# Altium schematic sheet MCU.SchDoc: ROBOX V2 - Microcontroller
size A4; DrawnBy: Jan Stappers; DocumentNumber: JSP016; Revision: B; SheetNumber: 2; SheetTotal: 6
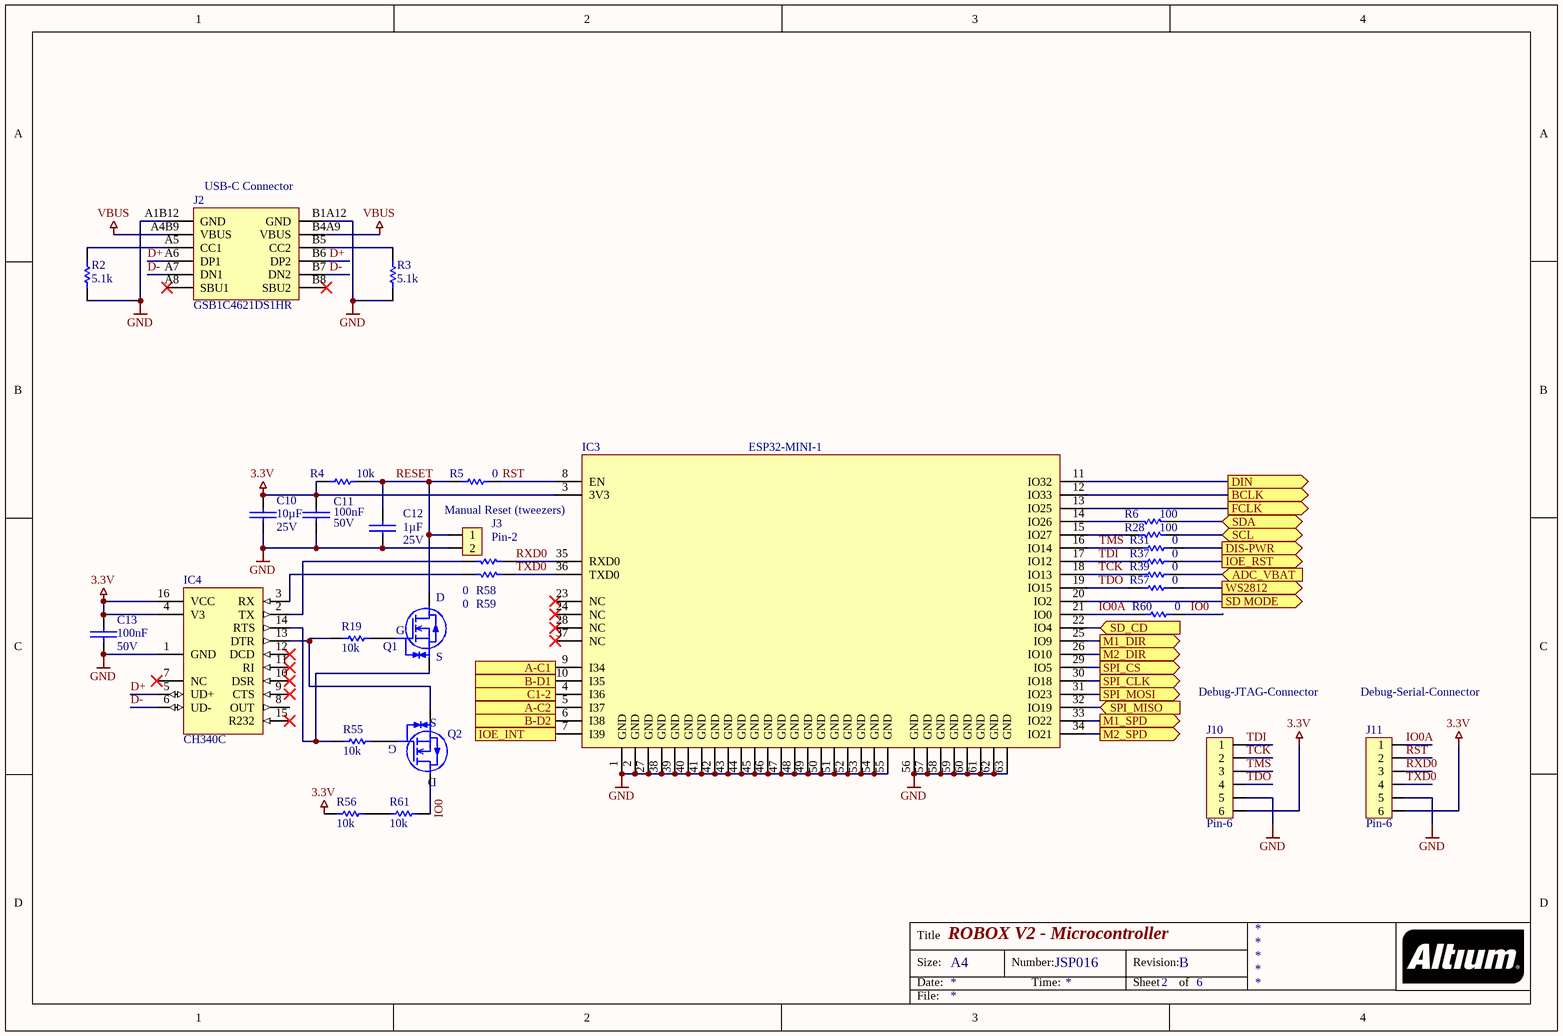
[diagram p0: MCU.SchDoc]

## Parts
C10  value 10µF  voltage: 25V  [C0603]  (hidden comment: cap_non_pol)
C11  value 100nF  voltage: 50V  [C0402]  (hidden comment: cap_non_pol)
C12  value 1µF  voltage: 25V  [C0603]  (hidden comment: cap_non_pol)
C13  value 100nF  voltage: 50V  [TH5.08]  (hidden comment: cap_non_pol)
IC3  ESP32-MINI-1  [ESP32-MINI-1]
IC4  CH340C  [SOP-16]
J2  GSB1C4621DS1HR  [GSB1C4621DS1HR]
J3  Pin-2  [2-PIN-EMPTY]
J10  Pin-6  [6-PIN-EMPTY]
J11  Pin-6  [6-PIN-EMPTY]
Q1  N_CH_MOSFET  [SOT-23(-3)]  (value not drawn)
Q2  N_CH_MOSFET  [SOT-23(-3)]  (value not drawn)
R2  value 5.1k  [R0402]  (hidden comment: resistor)
R3  value 5.1k  [R0402]  (hidden comment: resistor)
R4  value 10k  [R0402]  (hidden comment: resistor)
R5  value 0  [R0402]  (hidden comment: resistor)
R6  value 100  [R0402]  (hidden comment: resistor)
R19  value 10k  [R0402]  (hidden comment: resistor)
R28  value 100  [R0402]  (hidden comment: resistor)
R31  value 0  [R0402]  (hidden comment: resistor)
R37  value 0  [R0402]  (hidden comment: resistor)
R39  value 0  [R0402]  (hidden comment: resistor)
R55  value 10k  [R0402]  (hidden comment: resistor)
R56  value 10k  [R0402]  (hidden comment: resistor)
R57  value 0  [R0402]  (hidden comment: resistor)
R58  value 0  [R0402]  (hidden comment: resistor)
R59  value 0  [R0402]  (hidden comment: resistor)
R60  value 0  [R0402]  (hidden comment: resistor)
R61  value 10k  [R0402]  (hidden comment: resistor)

## Ports
A-C1 (in), A-C2 (in), ADC_VBAT (in), B-D1 (in), B-D2 (in), BCLK (out), C1-2 (in), DIN (out), DIS-PWR (out), FCLK (out), IOE_INT (in), IOE_RST (out), M1_DIR (out), M1_SPD (out), M2_DIR (out), M2_SPD (out), SCL (bidir), SD MODE (out), SD_CD (in), SDA (bidir), SPI_CLK (out), SPI_CS (out), SPI_MISO (in), SPI_MOSI (out), WS2812 (out)

## Nets
3.3V: C10.1 C11.2 C13.1 IC3.3(3V3) IC4.4(V3) IC4.16(VCC) J10.6 J11.6 R4.2 R56.1
GND: C10.2 C11.1 C12.2 C13.2 IC3.1(GND) IC3.2(GND) IC3.27(GND) IC3.38(GND) IC3.39(GND) IC3.40(GND) IC3.41(GND) IC3.42(GND) IC3.43(GND) IC3.44(GND) IC3.45(GND) IC3.46(GND) IC3.47(GND) IC3.48(GND) IC3.49(GND) IC3.50(GND) IC3.51(GND) IC3.52(GND) IC3.53(GND) IC3.54(GND) IC3.55(GND) IC3.56(GND) IC3.57(GND) IC3.58(GND) IC3.59(GND) IC3.60(GND) IC3.61(GND) IC3.62(GND) IC3.63(GND) IC4.1(GND) J2.A1B12(GND) J2.B1A12(GND) J3.2 J10.5 J11.5 R2.2 R3.2
VBUS: J2.A4B9(VBUS) J2.B4A9(VBUS)
A-C1: IC3.9(I34) ; port A-C1
A-C2: IC3.5(I37) ; port A-C2
ADC_VBAT: R39.1 ; port ADC_VBAT
B-D1: IC3.10(I35) ; port B-D1
B-D2: IC3.6(I38) ; port B-D2
BCLK: IC3.12(IO33) ; port BCLK
C1-2: IC3.4(I36) ; port C1-2
D+: IC4.5(UD+) J2.A6(DP1) J2.B6(DP2)
D-: IC4.6(UD-) J2.A7(DN1) J2.B7(DN2)
DIN: IC3.11(IO32) ; port DIN
DIS-PWR: R31.1 ; port DIS-PWR
FCLK: IC3.13(IO25) ; port FCLK
IO0: Q2.3(D) R60.1 R61.2
IO0A: IC3.21(IO0) J11.1 R60.2
IOE_INT: IC3.7(I39) ; port IOE_INT
IOE_RST: R37.1 ; port IOE_RST
M1_DIR: IC3.25(IO9) ; port M1_DIR
M1_SPD: IC3.33(IO22) ; port M1_SPD
M2_DIR: IC3.26(IO10) ; port M2_DIR
M2_SPD: IC3.34(IO21) ; port M2_SPD
RESET: C12.1 J3.1 Q1.3(D) R4.1 R5.2
RST: IC3.8(EN) J11.2 R5.1
RXD0: IC3.35(RXD0) J11.3 R58.1
SCL: R28.2 ; port SCL
SD MODE: IC3.20(IO2) ; port SD MODE
SD_CD: IC3.22(IO4) ; port SD_CD
SDA: R6.2 ; port SDA
SPI_CLK: IC3.30(IO18) ; port SPI_CLK
SPI_CS: IC3.29(IO5) ; port SPI_CS
SPI_MISO: IC3.32(IO19) ; port SPI_MISO
SPI_MOSI: IC3.31(IO23) ; port SPI_MOSI
TCK: IC3.18(IO13) J10.2 R39.2
TDI: IC3.17(IO12) J10.1 R37.2
TDO: IC3.19(IO15) J10.4 R57.2
TMS: IC3.16(IO14) J10.3 R31.2
TXD0: IC3.36(TXD0) J11.4 R59.1
WS2812: R57.1 ; port WS2812
NetIC3_14: IC3.14(IO26) R6.1
NetIC3_15: IC3.15(IO27) R28.1
NetIC4_2: IC4.2(TX) R58.2
NetIC4_3: IC4.3(RX) R59.2
NetIC4_13: IC4.13(DTR) Q2.2(S) R19.1
NetIC4_14: IC4.14(RTS) Q1.2(S) R55.1
NetJ2_A5: J2.A5(CC1) R2.1
NetJ2_B5: J2.B5(CC2) R3.1
NetQ1_1: Q1.1(G) R19.2
NetQ2_1: Q2.1(G) R55.2
NetR56_2: R56.2 R61.1

Not connected (* = marked no-connect by the designer): IC3 23(NC)* 24(NC)* 28(NC)* 37(NC)*; IC4 7(NC)* 8(OUT) 9(CTS)* 10(DSR)* 11(RI)* 12(DCD)* 15(R232)*; J2 A8(SBU1)* B8(SBU2)*

## Notes on the sheet
- (near J2) USB-C Connector
- (near IC3) Manual Reset (tweezers)
- (near J10) Debug-JTAG-Connector
- (near J11) Debug-Serial-Connector
- Title
- Size:
- Date:
- A4
- Number:
- Time:
- Revision:
- Sheet
- of
- File:

## Library data of the parts
C10 = 1: CAP CER 10UF 25V X5R 10% SMD; manufacturer_ref: GRM188R61E106KA73D; manufacturer: Murata Electronics; id: 1; tolerance: 10%; dielectric: X5R; package: 0603; supplier_1: digikey; supplier_1_partnumber: 490-18214-1-ND; price: 0,06969; status: active
C11 = 0: CAP CER 0.1UF 50V X5R 0402; manufacturer_ref: 490-16356-1-ND; manufacturer: Murata Electronics; id: 0; tolerance: 5%; dielectric: X5R; package: 0402; supplier_1: digikey; supplier_1_partnumber: 490-16356-1-ND; price: 0,00933; status: non stock
C12 = 34: CAP CER 1UF 25V X5R 0603; manufacturer_ref: CC0603KRX5R8BB105; manufacturer: YAGEO; id: 34; tolerance: 10%; dielectric: X5R; package: 0603; supplier_1: digikey; supplier_1_partnumber: 311-1445-1-ND; price: 0,01837; status: active
C13 = 51: CAP CER TH 100nF X7R 50V; manufacturer_ref: C2761753; manufacturer: FH; id: 51; tolerance: 10%; dielectric: X7R; package: TH5.08; supplier_1: lcsc; supplier_1_partnumber: C385200; price: 0,0237; status: active
IC3 = 80: RF TXRX MOD BT TRACE ANT CHAS MT; manufacturer_ref: ESP32-MINI-1-N4; manufacturer: Espressif Systems; id: 80; type: MCU Wireless (Bluetooth); package: 63-SMD; supplier_1: digikey; supplier_1_partnumber: 1965-ESP32-MINI-1-N4CT-ND; price: 2,12; status: active
IC4 = 79: 2Mbps Transceiver USB 2.0 SOP-16 USB ICs ROHS; manufacturer: WCH(Jiangsu Qin Heng); id: 79; manufacturer_ref: CH340C; type: Wired (USB TO SERIAL); package: 16-SOP; supplier_1: lcsc; supplier_1_partnumber: C84681; price: 0,4996; status: active
J2 = 55: USB2.0, TYPE C, MID MOUNT, CENTE; manufacturer: Amphenol ICC (Commercial Products); id: 55; nbr_positions_total: 16; manufacturer_ref: GSB1C4621DS1HR; package: Pin-16DR; supplier_1: digikey; supplier_1_partnumber: 664-GSB1C4621DS1HRCT-ND; price: 0,52; status: active
J3 = 18: CONN TH solder pad; manufacturer_ref: TH-2; id: 18; nbr_positions_total: 2; package: Pin-2SR; price: 0
J10 J11 = 60: CONN TH solder pad; manufacturer_ref: 6-Pin TH; id: 60; nbr_positions_total: 6; package: Pin-6SR; price: 0; status: active
Q1 Q2 = 7: MOSFET N-CH 100V 170MA SOT23-3; manufacturer_ref: BSS123-7-F; manufacturer: Diodes Incorporated; id: 7; current_rating: 0.170A; voltage_vgs_min: 20V; type: N channel; voltage_vds: 100V; package: SOT23-3; supplier_1: digikey; supplier_1_partnumber: NTR4003NT1GOSCT-ND; price: 0,0395; status: active
R2 R3 = 94: RES 5.1K OHM 1% 1/16W 0402; manufacturer_ref: RMCF0402FT5K10; manufacturer: Stackpole Electronics Inc; id: 94; tolerance: 1%; power: 1/16W; package: 0402; supplier_1: digikey; supplier_1_partnumber: RMCF0402FT5K10CT-ND; price: 0,09; status: active
R4 R19 R55 R56 R61 = 6: RES SMD 10K OHM 1% 1/10W 0402; manufacturer_ref: ERJ-2RKF1002X; manufacturer: Panasonic Electronic Components; id: 6; tolerance: 1%; power: 1/10W; package: 0402; supplier_1: digikey; supplier_1_partnumber: P10.0KLCT-ND; price: 0,00703; status: active
R5 R31 R37 R39 R57-R60 = 8: RES SMD 0 OHM JUMPER 1/10W 0402; manufacturer_ref: ERJ-2GE0R00X; manufacturer: Panasonic Electronic Components; id: 8; tolerance: 1%; power: 1/10W; package: 0402; supplier_1: digikey; supplier_1_partnumber: P0.0JCT-ND; price: 0,00487; status: active
R6 R28 = 29: RES SMD 100 OHM 1% 1/5W 0402; manufacturer_ref: CRCW0402100RFKEDHP; manufacturer: Vishay Dale; id: 29; tolerance: 1%; power: 1/5W; package: 0402; supplier_1: digikey; supplier_1_partnumber: 541-100YCT-ND; price: 0,01933; status: active